# EAGLE design oneLab PCB V4 (EAGLE 9.6.2)
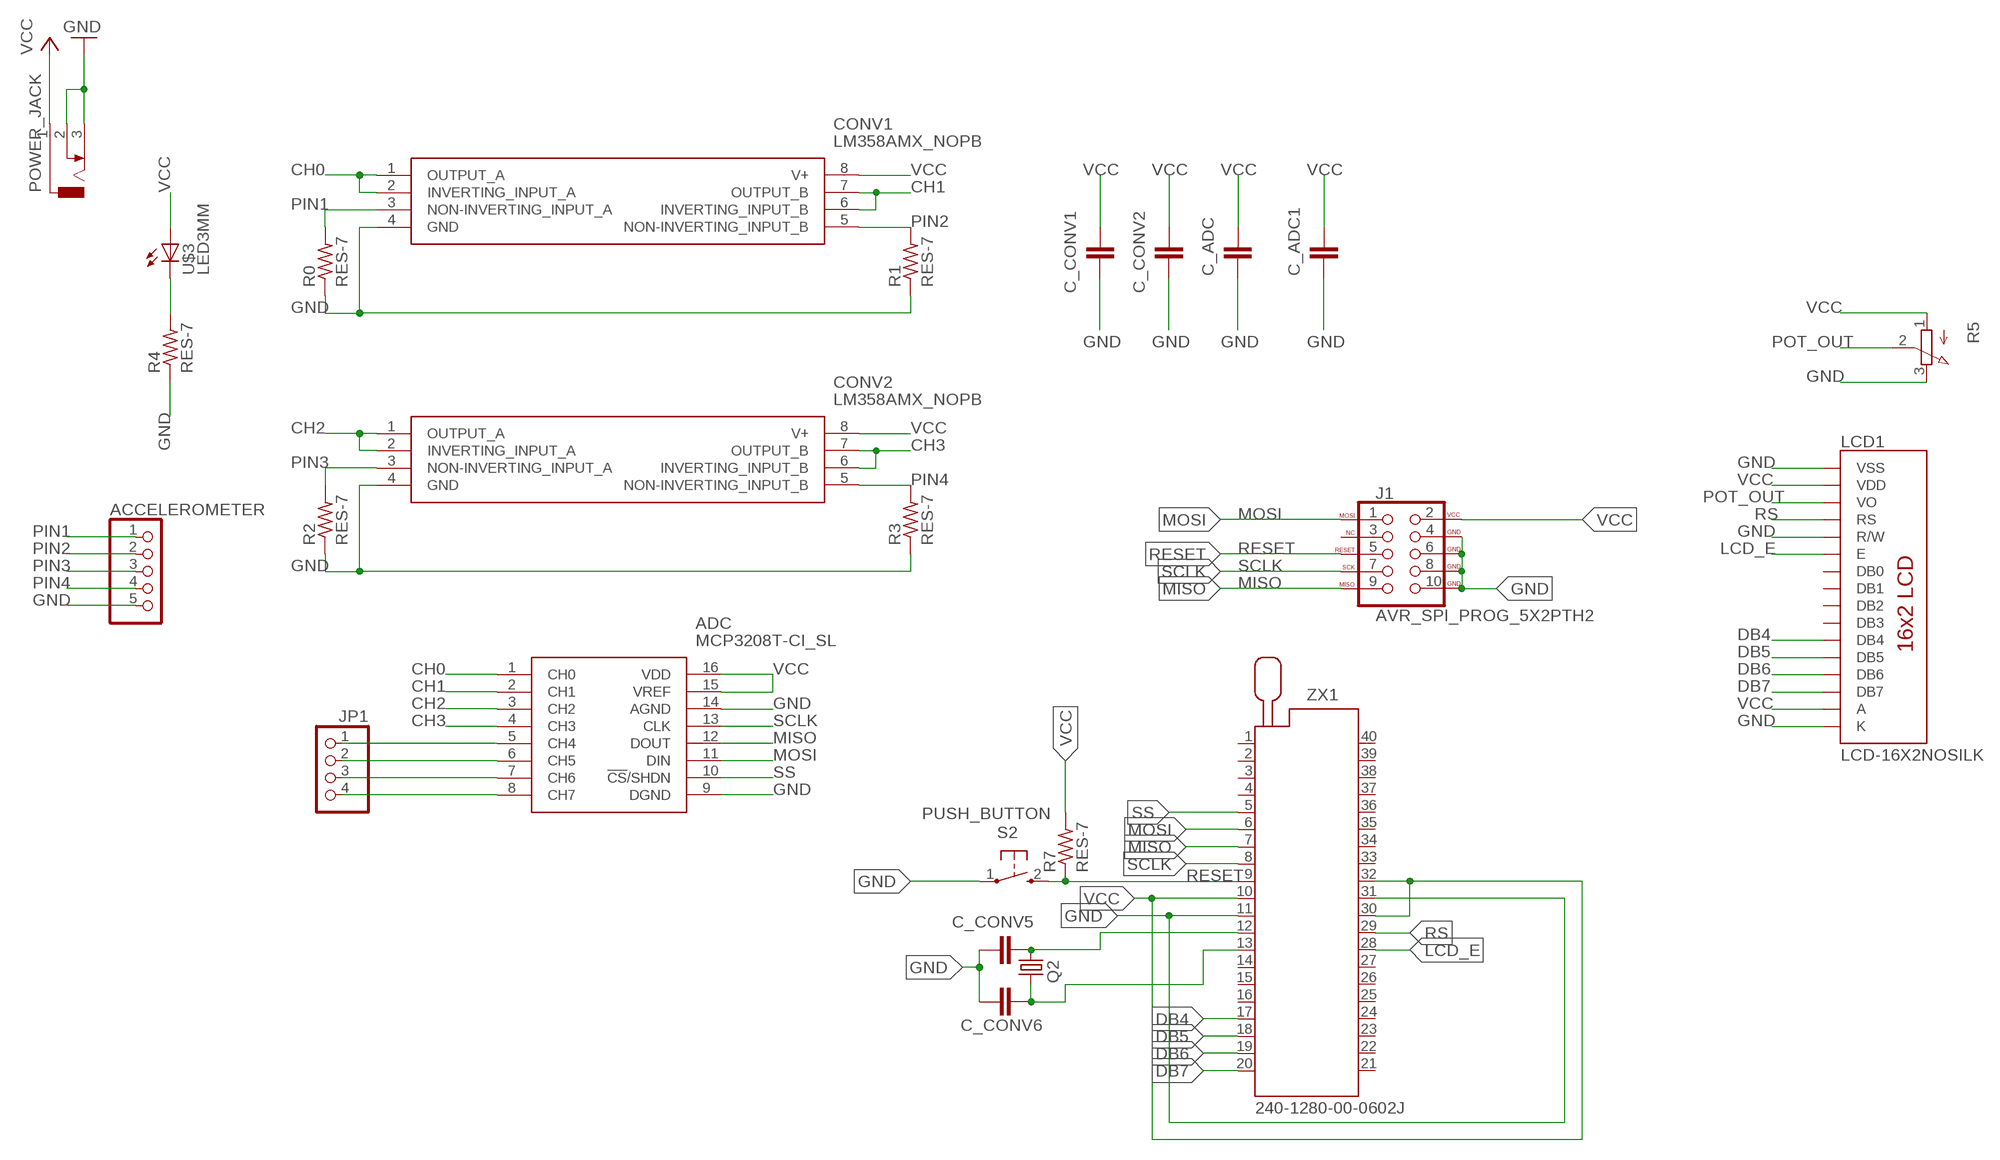
[diagram p0: schematic, sheet 1]

## Parts
ACCELEROMETER  PINHD-5_DATA  [1X05_DATA]
ADC  MCP3208T-CI_SL  [SOIC127P600X175-16N]
C_ADC  CAPACITOR  [C025-025X050]
C_ADC1  CAPACITOR  [C025-025X050]
C_CONV1  CAPACITOR  [C025-025X050]
C_CONV2  CAPACITOR  [C025-025X050]
C_CONV5  CAPACITOR  [C025-025X050]
C_CONV6  CAPACITOR  [C025-025X050]
CONV1  LM358AMX_NOPB  [SOIC127P600X175-8N]
CONV2  LM358AMX_NOPB  [SOIC127P600X175-8N]
J1  AVR_SPI_PROG_5X2PTH2  [2X5-SHROUDED]
JP1  PINHD-4_DATA  [1X04_DATA]
LCD1  LCD-16X2NOSILK  [LCD-16X2_NOSILK]
POWER_JACK  CON_JACK  [DCJ0303]
Q2  CRYSTALHC49U-V  [HC49U-V]
R0  RES-7  [0204/7]
R1  RES-7  [0204/7]
R2  RES-7  [0204/7]
R3  RES-7  [0204/7]
R4  RES-7  [0204/7]
R5  POT  [3RP/1610N]
R7  RES-7  [0204/7]
S2  PUSH_BUTTON  [B3F-10XX]
U$3  LED3MM  [LED3MM]
ZX1  240-1280-00-0602J  [240-1280-00-0602J]

## Nets
CH0: ADC.1(CH0) CONV1.1(OUTPUT_A) CONV1.2(INVERTING_INPUT_A)
CH1: ADC.2(CH1) CONV1.6(INVERTING_INPUT_B) CONV1.7(OUTPUT_B)
CH2: ADC.3(CH2) CONV2.1(OUTPUT_A) CONV2.2(INVERTING_INPUT_A)
CH3: ADC.4(CH3) CONV2.6(INVERTING_INPUT_B) CONV2.7(OUTPUT_B)
DB4: LCD1.11(DB4) ZX1.17
DB5: LCD1.12(DB5) ZX1.18
DB6: LCD1.13(DB6) ZX1.19
DB7: LCD1.14(DB7) ZX1.20
GND: ACCELEROMETER.5 ADC.9(DGND) ADC.14(AGND) C_ADC1.2 C_ADC.2 C_CONV1.2 C_CONV2.2 C_CONV5.1 C_CONV6.1 CONV1.4(GND) CONV2.4(GND) J1.4(GND) J1.6(GND) J1.8(GND) J1.10(GND) LCD1.1(VSS) LCD1.5(R/W) LCD1.16(K) POWER_JACK.2 POWER_JACK.3 R0.1 R1.1 R2.1 R3.1 R4.1 R5.3(E) S2.1(P) ZX1.11 ZX1.31
LCD_E: LCD1.6(E) ZX1.28
MISO: ADC.12(DOUT) J1.9(MISO) ZX1.7
MOSI: ADC.11(DIN) J1.1(MOSI) ZX1.6
N$1: ADC.5(CH4) JP1.1
N$2: ADC.6(CH5) JP1.2
N$3: ADC.7(CH6) JP1.3
N$4: ADC.8(CH7) JP1.4
N$9: C_CONV5.2 Q2.2 ZX1.12
N$10: R4.2 U$3.K(C)
N$11: C_CONV6.2 Q2.1 ZX1.13
PIN1: ACCELEROMETER.1 CONV1.3(NON-INVERTING_INPUT_A) R0.2
PIN2: ACCELEROMETER.2 CONV1.5(NON-INVERTING_INPUT_B) R1.2
PIN3: ACCELEROMETER.3 CONV2.3(NON-INVERTING_INPUT_A) R2.2
PIN4: ACCELEROMETER.4 CONV2.5(NON-INVERTING_INPUT_B) R3.2
POT_OUT: LCD1.3(VO) R5.2(S)
RESET: J1.5(RESET) R7.1 S2.2(S) ZX1.9
RS: LCD1.4(RS) ZX1.29
SCLK: ADC.13(CLK) J1.7(SCK) ZX1.8
SS: ADC.10(!CS!/SHDN) ZX1.5
VCC: ADC.15(VREF) ADC.16(VDD) C_ADC1.1 C_ADC.1 C_CONV1.1 C_CONV2.1 CONV1.8(V+) CONV2.8(V+) J1.2(VCC) LCD1.2(VDD) LCD1.15(A) POWER_JACK.1 R5.1(A) R7.2 U$3.A ZX1.10 ZX1.30 ZX1.32
Unconnected: J1.3(NC) LCD1.7(DB0) LCD1.8(DB1) LCD1.9(DB2) LCD1.10(DB3) ZX1.1 ZX1.2 ZX1.3 ZX1.4 ZX1.14 ZX1.15 ZX1.16 ZX1.21 ZX1.22 ZX1.23 ZX1.24 ZX1.25 ZX1.26 ZX1.27 ZX1.33 ZX1.34 ZX1.35 ZX1.36 ZX1.37 ZX1.38 ZX1.39 ZX1.40

## Library data of the parts
ACCELEROMETER = MIA_LIBRARY-2-2-2:PINHD-5_DATA: PIN HEADER
ADC = oneLab Lib:MCP3208T-CI_SL: Microchip Technology MCP3208T-CI/SL, 12 bit Serial ADC Pseudo Differential Input, 16-Pin SOIC Source: Datasheet <https://ww1.microchip.com/downloads/en/DeviceDoc/21298c.pdf>; ARROW_PART_NUMBER: MCP3208T-CI/SL; ARROW_PRICE-STOCK: https://www.arrow.com/en/products/mcp3208t-cisl/microchip-technology; DESCRIPTION: Microchip Technology MCP3208T-CI/SL, 12 bit Serial ADC Pseudo Differential Input, 16-Pin SOIC; HEIGHT: 1.75mm; MANUFACTURER_NAME: Microchip; MANUFACTURER_PART_NUMBER: MCP3208T-CI/SL; MOUSER_PART_NUMBER: 579-MCP3208T-CI/SL; MOUSER_PRICE-STOCK: https://www.mouser.co.uk/ProductDetail/Microchip-Technology/MCP3208T-CI-SL?qs=qUiwOUCta0eE3HgCyUY2CA%3D%3D
C_ADC C_ADC1 C_CONV1 C_CONV2 C_CONV5 C_CONV6 = oneLab Lib:CAPACITOR
CONV1 CONV2 = oneLab Lib:LM358AMX_NOPB: Operational Amplifiers - Op Amps LOW PWR DUAL OP AMP Source: Datasheet <http://www.ti.com/lit/ds/symlink/lm358-n.pdf>; ARROW_PART_NUMBER: LM358AMX/NOPB; ARROW_PRICE-STOCK: https://www.arrow.com/en/products/lm358amxnopb/texas-instruments; DESCRIPTION: Operational Amplifiers - Op Amps LOW PWR DUAL OP AMP; HEIGHT: 1.75mm; MANUFACTURER_NAME: Texas Instruments; MANUFACTURER_PART_NUMBER: LM358AMX/NOPB; MOUSER_PART_NUMBER: 926-LM358AMX/NOPB; MOUSER_PRICE-STOCK: https://www.mouser.co.uk/ProductDetail/Texas-Instruments/LM358AMX-NOPB?qs=QbsRYf82W3GCS6w419KcQg%3D%3D
J1 = oneLab Lib:AVR_SPI_PROG_5X2: AVR 10-pin ICSP Header This is the standard AVR In Circuit Serial Programming header. Minimal, but includes pin one indicator. Works with standard Olimex programmers. SparkFun Products: 2x5 AVR ICSP Male Header <https://www.sparkfun.com/products/778> - PTH 2x5 Pin Shrouded Header <https://www.sparkfun.com/products/8506> - PTH2; PROD_ID: CONN-08671; SF_ID: PRT-08506
JP1 = oneLab Lib:PINHD-4_DATA: PIN HEADER
LCD1 = oneLab Lib:LCD-16X2: Standard text-only 16x2 parallel input LCD Basic 16 character by 2 line display. Typically utilizes the extremely common HD44780 parallel interface chipset SparkFun Products: Basic 16x2 Green <https://www.sparkfun.com/products/255> Basic 8x2 Green <https://www.sparkfun.com/products/11122>; SF_ID: LCD-00255
POWER_JACK = oneLab Lib:CON_JACK: DC POWER JACK Source: DCJ0303.pdf; OC_FARNELL: unknown; OC_NEWARK: unknown
Q2 = oneLab Lib:CRYSTAL: CRYSTAL; OC_FARNELL: 1666969; OC_NEWARK: unknown
R0 R1-R4 R7 = oneLab Lib:RES-7
R5 = oneLab Lib:POT: 16mm Potentiometer one level Source: http://www.alphapotentiometers.net/html/16mm_pot_2.html
S2 = oneLab Lib:PUSH_BUTTON: OMRON SWITCH
U$3 = oneLab Lib:LED3MM
ZX1 = oneLab Lib:240-?-00-0602J: Zero Insertion Force Socked Source: http://www.3M.com/ehpd

## Board
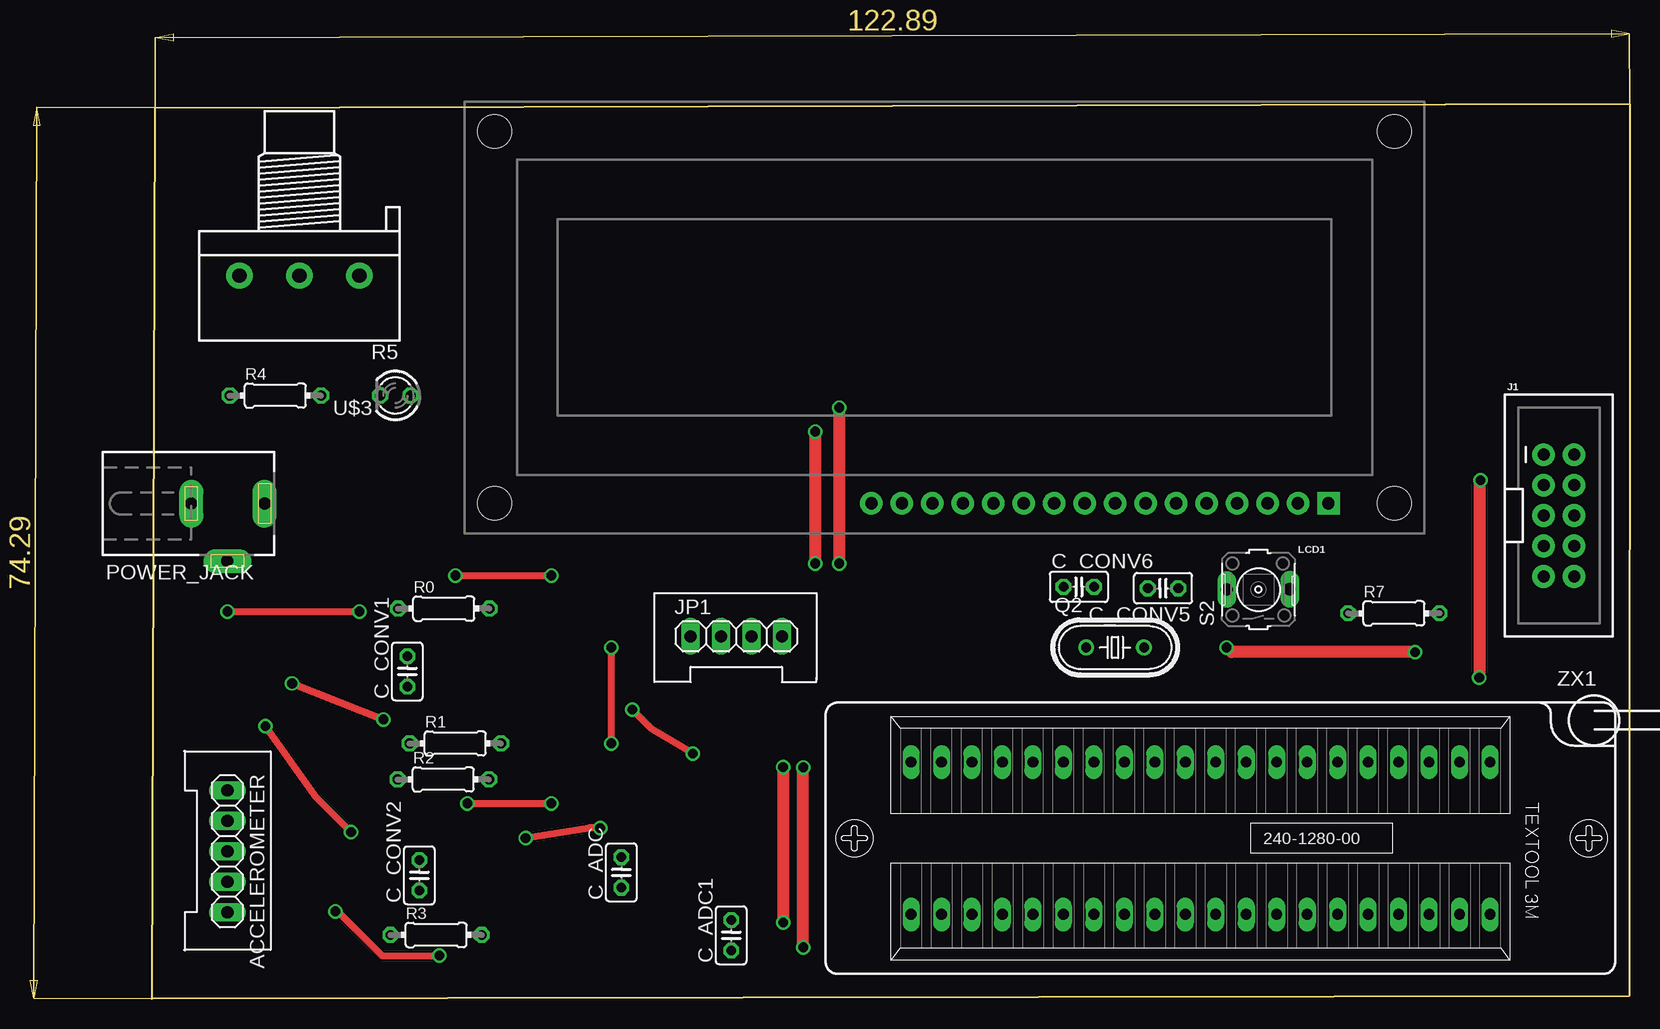
[diagram p1: board, top side]
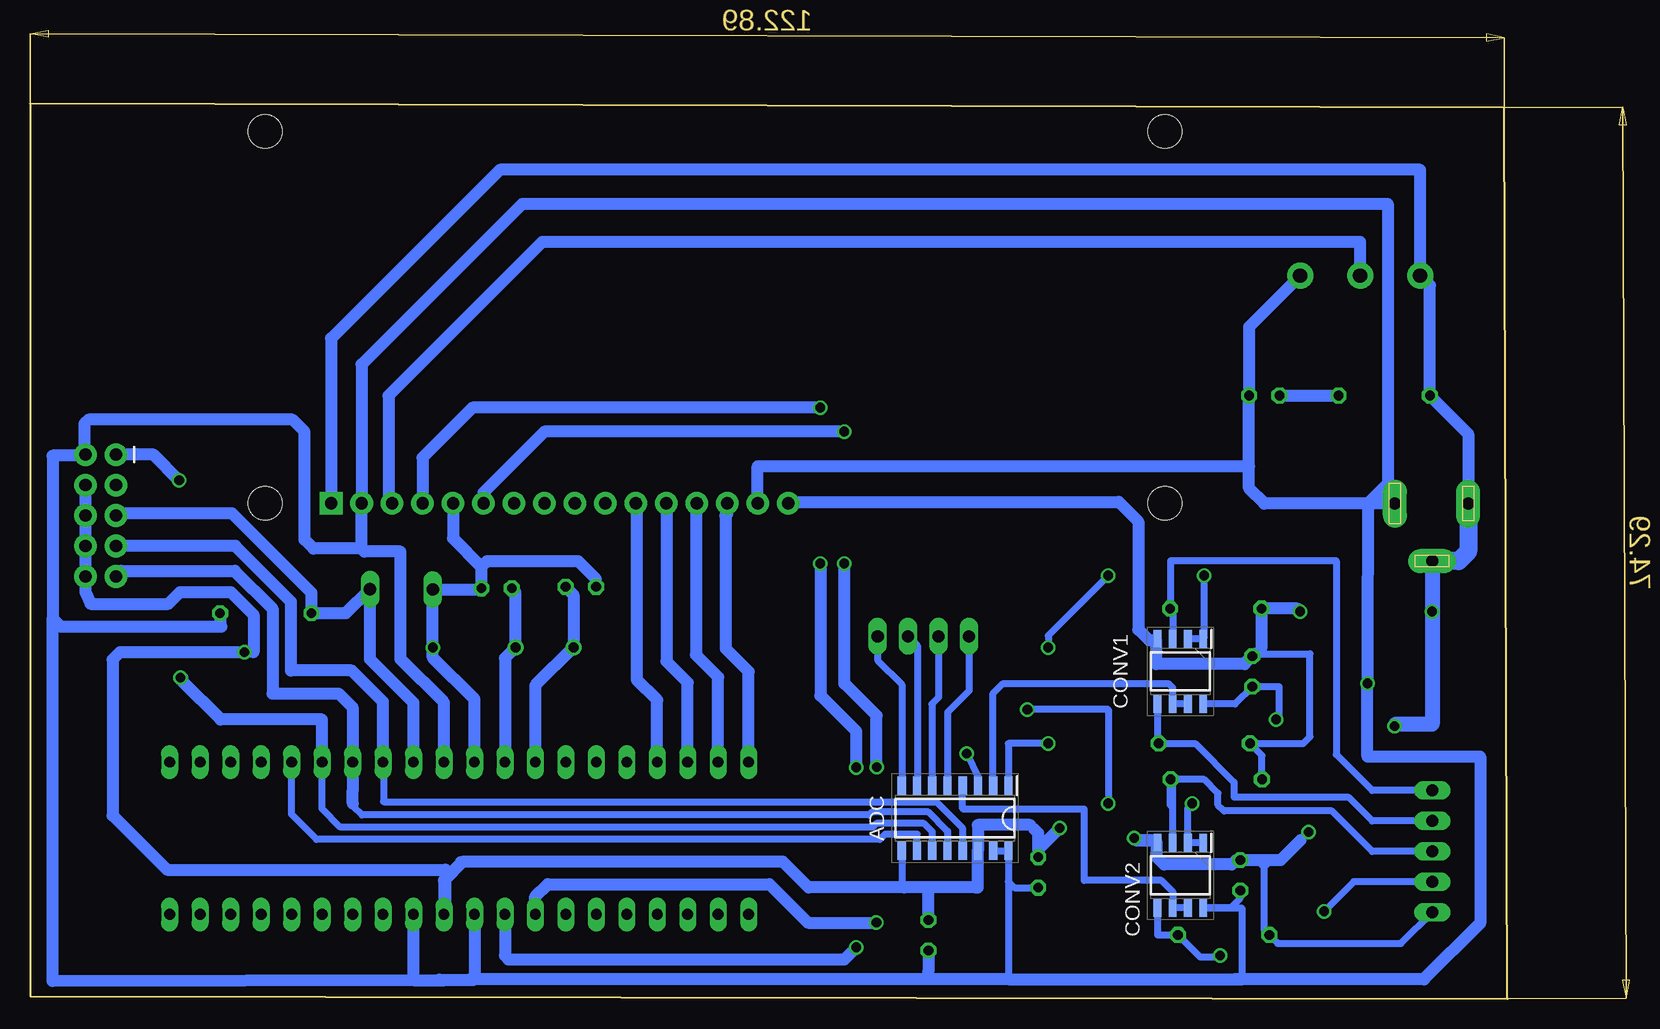
[diagram p2: board, bottom side, seen from below]

Size 123.16 x 74.63 mm. Coordinates in mm from the lower left corner, seen from the top.
Outline: 0.27,74.29 123.16,74.63 123.13,0.22 0,0 0.27,74.29
Copper layers (1*16): Top 0.035mm / dielectric 1.5mm / Bottom 0.035mm
Design rules "default *": minimum track width 0.6mm, minimum drill 0.35mm, track to track 0.25mm, track to pad 0.25mm, pad to pad 0.25mm, via to via 0.25mm, smd to smd 0.25mm, copper to edge 0.4mm, drill to drill 6mil, minimum pad ring 10mil, minimum via ring 8mil, stop-mask expansion 4mil, vias tented up to drill 0mil, thermal gap 10mil

### Footprints (pad centres in the part's own frame; a part is rotated, then mirrored left to right if it is on the bottom)
1X05_DATA = drill 1.016 long: 1 -5.08,0; 2 -2.54,0; 3 0,0; 4 2.54,0; 5 5.08,0
SOIC127P600X175-16N = smd 1.525 x 0.7: 1 -2.712,4.445; 2 -2.712,3.175; 3 -2.712,1.905; 4 -2.712,0.635; 5 -2.712,-0.635; 6 -2.712,-1.905; 7 -2.712,-3.175; 8 -2.712,-4.445; 9 2.712,-4.445; 10 2.712,-3.175; 11 2.712,-1.905; 12 2.712,-0.635; 13 2.712,0.635; 14 2.712,1.905; 15 2.712,3.175; 16 2.712,4.445
C025-025X050 = drill 0.813 octagon: 1 -1.27,0; 2 1.27,0
SOIC127P600X175-8N = smd 1.528 x 0.65: 1 -2.711,1.905; 2 -2.711,0.635; 3 -2.711,-0.635; 4 -2.711,-1.905; 5 2.711,-1.905; 6 2.711,-0.635; 7 2.711,0.635; 8 2.711,1.905
2X5-SHROUDED = drill 1.016 pad 1.88: 1 -1.27,5.08; 2 1.27,5.08; 3 -1.27,2.54; 4 1.27,2.54; 5 -1.27,0; 6 1.27,0; 7 -1.27,-2.54; 8 1.27,-2.54; 9 -1.27,-5.08; 10 1.27,-5.08
1X04_DATA = drill 1.016 long: 1 -3.81,0; 2 -1.27,0; 3 1.27,0; 4 3.81,0
LCD-16X2_NOSILK = drill 1.016 pad 1.88 square: 1 -32,15.5 | drill 1.016 pad 1.88: 2 -29.46,15.5; 3 -26.92,15.5; 4 -24.38,15.5; 5 -21.84,15.5; 6 -19.3,15.5; 7 -16.76,15.5; 8 -14.22,15.5; 9 -11.68,15.5; 10 -9.14,15.5; 11 -6.6,15.5; 12 -4.06,15.5; 13 -1.52,15.5; 14 1.02,15.5; 15 3.56,15.5; 16 6.1,15.5 | hole 2.8: -37.5,15.5; -37.5,-15.5; 37.5,15.5; 37.5,-15.5
DCJ0303 = drill 1 pad 2 long: 1 0,3.1; 2 4.8,0; 3 0,-3
HC49U-V = drill 0.813: 1 -2.413,0; 2 2.413,0
0204/7 = drill 0.813 octagon: 1 -3.81,0; 2 3.81,0
3RP/1610N = drill 1.2 pad 2.184: 1 -5,0; 2 0,0; 3 5,0
B3F-10XX = drill 1.016 long: 1 0.013,2.636; 2 0.029,-2.605
LED3MM = drill 0.813 octagon: A -1.27,0; K 1.27,0
240-1280-00-0602J = drill 0.9 long: 1 -24.13,-6.35; 2 -21.59,-6.35; 3 -19.05,-6.35; 4 -16.51,-6.35; 5 -13.97,-6.35; 6 -11.43,-6.35; 7 -8.89,-6.35; 8 -6.35,-6.35; 9 -3.81,-6.35; 10 -1.27,-6.35; 11 1.27,-6.35; 12 3.81,-6.35; 13 6.35,-6.35; 14 8.89,-6.35; 15 11.43,-6.35; 16 13.97,-6.35; 17 16.51,-6.35; 18 19.05,-6.35; 19 21.59,-6.35; 20 24.13,-6.35; 21 24.13,6.35; 22 21.59,6.35; 23 19.05,6.35; 24 16.51,6.35; 25 13.97,6.35; 26 11.43,6.35; 27 8.89,6.35; 28 6.35,6.35; 29 3.81,6.35; 30 1.27,6.35; 31 -1.27,6.35; 32 -3.81,6.35; 33 -6.35,6.35; 34 -8.89,6.35; 35 -11.43,6.35; 36 -13.97,6.35; 37 -16.51,6.35; 38 -19.05,6.35; 39 -21.59,6.35; 40 -24.13,6.35

### Placement (x,y rotation side)
ACCELEROMETER  6.27,12.29 270 top
ADC  46.05,15.06 270 bottom
C_ADC  39.12,10.54 90 top
C_ADC1  48.27,5.29 90 top
C_CONV1  21.27,27.29 90 top
C_CONV2  22.27,10.29 90 top
C_CONV5  84.27,34.22 180 top
C_CONV6  77.25,34.35 0 top
CONV1  27.27,27.29 270 bottom
CONV2  27.27,10.29 270 bottom
J1  117.27,40.29 0 top
JP1  48.69,30.22 0 top
LCD1  66.06,56.81 180 top
POWER_JACK  6.27,41.29 270 top
Q2  80.27,29.29 0 top
R0  24.32,32.53 0 top
R1  25.27,21.29 0 top
R2  24.27,18.29 0 top
R3  23.67,5.32 0 top
R4  10.27,50.29 0 top
R5  12.27,60.29 180 top
R7  103.51,32.14 0 top
S2  92.22,34.12 90 top
U$3  20.27,50.29 180 top
ZX1  87.39,13.39 180 top

### Tracks (layer width: path | path; a pad name or v marks a point on that pad's centre or on a via)
CH0  (via drill 0.8)
  Top 0.6: v25.27,35.29 v33.27,35.29 | v38.27,29.29 v38.27,21.29
  Bottom 0.6: CONV1.2 CONV1.1 25.27,30.1 v25.27,35.29 | v33.27,35.29 38.27,30.29 v38.27,29.29 | v38.27,21.29 41.61,21.29 ADC.1
CH1
  Bottom 0.6: CONV1.7 CONV1.6 27.91,25.93 28.27,26.29 42.05,26.29 42.88,25.47 ADC.2
CH2  (via drill 0.8)
  Top 0.6: v26.27,16.29 v33.27,16.29 | v45.07,20.44 45.07,20.45 41.62,22.52 v40.02,24.12
  Bottom 0.6: CONV2.1 CONV2.2 26.64,15.93 v26.27,16.29 | v33.27,16.29 33.27,24.12 v40.02,24.12 | v45.07,20.44 44.12,18.5 ADC.3
CH3
  Bottom 0.6: CONV2.7 CONV2.6 27.91,8.93 28.84,9.86 35.27,9.86 35.27,15.82 45.42,15.85 ADC.4
DB4
  Bottom 1: ZX1.17 70.88,24.9 72.59,26.61 72.59,41.23 LCD1.11
DB5
  Bottom 1: ZX1.18 68.34,26.36 70.12,28.14 LCD1.12
DB6
  Bottom 1: ZX1.19 65.8,26.82 67.66,28.68 67.66,41.23 LCD1.13
DB7
  Bottom 1: ZX1.20 63.26,27.28 65.15,29.17 65.15,40.24 65.2,40.29 65.04,40.45 LCD1.14
GND  (via drill 0.8, 0.8 pad 1)
  Top 0.6: v6.27,32.29 v17.27,32.29 | v16.59,13.89 13.69,16.79 v9.43,22.75 | v37.34,14.22 37.32,14.25 36.39,14.25 31.12,13.41 v31.14,13.41
  Top 1: v105.27,28.91 89.97,28.91 v89.59,29.29
  Bottom 0.6: 44.59,9.29 44.32,9.29 44.14,9.29 | 39.44,14.13 39.8,14.49 | 44.32,14.49 44.27,14.49 44.27,14.29 44.14,14.49 | 20.51,29.33 C_CONV1.2 | 21.07,28.77 16.47,28.77 16.47,21.85 17.03,21.29 R1.1 20.46,20.29 R2.1 | 20.27,11.29 20.27,5.74 R3.1 19.15,4.61 8.87,4.61 ACCELEROMETER.5 | 29.27,29.91 CONV1.4 | v17.27,32.29 17.51,32.53 | v16.59,13.89 17.23,13.25 | 20.27,11.56 20.54,11.56 | 29.37,13.2 29.59,13.41 v31.14,13.41 | ADC.9 50.5,9.51 50.27,9.29 | CONV2.4 29.27,13.29 29.26,13 | J1.8 118.77,37.79 118.54,37.79 | 118.77,40.29 J1.6
  Bottom 0.8: CONV2.4 29.37,13.2
  Bottom 1: 60.4,11.44 87.14,11.4 88.66,9.88 ZX1.31 88.56,7.14 88.56,10.76 111.74,10.76 116.27,15.29 116.27,28.29 115.66,28.91 v105.27,28.91 104.53,28.91 104.53,32.02 106.43,33.91 110.65,33.91 111.63,32.93 118.12,32.93 118.54,33.91 J1.10 J1.8 118.54,37.79 J1.6 J1.4 | 60.4,11.44 87.27,11.4 | 20.51,29.33 R0.1 17.51,32.53 | 21.07,28.77 C_CONV1.2 21.94,27.9 29.27,27.9 29.27,29.91 29.89,29.91 30.77,30.79 30.77,39.79 32.41,41.43 59.84,41.43 LCD1.16 | POWER_JACK.3 3.27,47.1 R4.1 6.46,59.48 R5.3 7.27,69.11 84,69.11 98.06,55.05 LCD1.1 | C_CONV6.1 75.98,35 77.45,36.47 85.09,36.47 85.54,36.02 | 85.54,36.02 C_CONV5.1 85.64,34.13 S2.1 v89.59,29.29 89.59,28.45 86.12,24.98 ZX1.11 | LCD1.5 87.9,38.38 85.54,36.02 | 44.32,9.29 48.27,9.29 | 48.27,9.29 50.27,9.29 58.25,9.29 60.4,11.44 | 39.44,14.13 39.12,13.81 C_ADC.2 39.12,12.45 v37.34,14.22 | 39.8,14.49 44.14,14.49 ADC.14 44.14,9.29 | 17.23,13.25 18.91,11.56 20.27,11.56 | 20.27,11.29 20.54,11.56 C_CONV2.2 22.63,11.56 23.01,11.19 28.63,11.19 29.26,11.82 29.26,13 | v31.14,13.41 30.92,13.2 29.37,13.2 | C_ADC1.2 48.27,9.29
  Bottom 1.27: POWER_JACK.2 v6.27,32.29 6.27,22.9 9.27,22.9 v9.43,22.75
  Bottom 1.5: POWER_JACK.3 3.27,37.29 4.07,36.49 POWER_JACK.2
LCD_E  (via drill 0.8)
  Top 1: v52.6,6.35 52.59,6.36 v52.59,19.33 | v55.27,47.29 v55.27,36.29
  Bottom 1: ZX1.28 81.04,8.53 80.02,9.55 61.53,9.55 58.33,6.35 v52.6,6.35 | v52.59,19.33 52.59,23.61 55.27,26.29 v55.27,36.29 | v55.27,47.29 80.27,47.29 85.36,42.21 LCD1.6
MISO
  Bottom 0.6: ADC.12 46.71,12.38 46.67,13.98 48.27,15.57 52.99,15.57 53.25,15.32 95.49,15.32 96.27,16.1 96.27,16.29 | 96.28,17.29 ZX1.7
  Bottom 1: 96.27,16.29 96.28,17.29 96.28,24.3 97.44,25.46 102.95,25.46 102.95,32.54 106.09,35.68 115.54,35.68 J1.9
MOSI  (via drill 0.8)
  Top 1: v110.63,26.77 110.62,26.78 110.62,43.23 v110.73,43.23
  Bottom 0.6: ADC.11 47.95,13.93 48.65,14.62 52.61,14.62 52.92,14.31 97.29,14.31 98.82,15.84 ZX1.6
  Bottom 1: ZX1.6 98.82,23.29 107.27,23.29 110.46,26.48 110.46,26.77 v110.63,26.77 | v110.73,43.23 112.87,45.37 J1.1
N$1
  Bottom 0.6: JP1.1 44.88,25.68 46.69,23.88 ADC.5
N$2
  Bottom 0.6: JP1.2 47.42,25.14 47.99,24.58 47.99,17.81 ADC.6
N$3
  Bottom 0.6: JP1.3 49.2,29.46 49.2,17.98 49.22,17.96 ADC.7
N$4
  Bottom 0.6: JP1.4 52.5,28.22 50.49,26.21 50.49,17.93 50.5,17.93 ADC.8
N$9
  Bottom 1: ZX1.12 83.58,28.4 Q2.2 82.69,33.91 C_CONV5.2
N$10
  Bottom 1: U$3.K R4.2
N$11
  Bottom 1: ZX1.13 81.04,26.11 Q2.1 77.86,33.69 C_CONV6.2
PIN1
  Bottom 0.6: CONV1.3 27.91,32.53 R0.2 28.08,32.58 28.08,36.52 14.27,36.52 14.27,20.37 11.27,17.37 ACCELEROMETER.1
PIN2
  Bottom 0.6: CONV1.5 29.18,21.39 R1.2 26.04,21.29 22.8,18.05 22.8,16.83 13.27,16.83 11.27,14.83 ACCELEROMETER.2
PIN3
  Bottom 0.6: CONV2.3 27.91,18.12 R2.2 | ACCELEROMETER.3 11.27,12.29 14.63,15.65 23.63,15.65 24.12,16.14 24.12,17.14 25.27,18.29 R2.2 | 28.08,16.1 R2.2
PIN4  (via drill 0.8)
  Top 0.6: v15.27,7.29 15.47,7.29 19.16,3.61 v23.96,3.61
  Bottom 0.6: CONV2.5 29.18,5.32 R3.2 25.63,3.48 24.09,3.48 v23.96,3.61 | ACCELEROMETER.4 12.81,9.75 v15.27,7.29
POT_OUT
  Bottom 1: R5.2 12.27,63.1 80.47,63.1 93.27,50.29 93.27,41.6 LCD1.3
RESET
  Bottom 1: ZX1.9 91.2,24.68 94.83,28.3 S2.2 96.83,32.14 R7.1 99.7,33.85 106.34,40.49 115.81,40.49 J1.5
RS  (via drill 0.8)
  Top 1: v54.27,4.29 v54.27,19.29 | v57.27,49.29 v57.27,36.29
  Bottom 1: ZX1.29 83.58,3.6 83.27,3.29 55.27,3.29 v54.27,4.29 | v54.27,19.29 54.27,22.29 57.27,25.29 v57.27,36.29 | v57.27,49.29 86.27,49.29 90.44,45.13 LCD1.4
SCLK
  Bottom 0.6: ADC.13 45.45,12.39 45.45,14.27 47.61,16.43 93.71,16.43 93.71,19.7 ZX1.8
  Bottom 1: ZX1.8 93.74,24.76 96.34,27.36 101.4,27.36 101.4,33.1 106.05,37.75 J1.7
SS
  Bottom 0.6: ADC.10 49.22,13.71 49.24,13.73 51.89,13.73 52.32,13.29 99.27,13.29 101.36,15.38 ZX1.5
VCC  (via drill 0.8)
  Top 0.6: v11.67,26.29 v19.27,23.29
  Bottom 0.6: ADC.15 ADC.16 | ADC.16 41.61,9.75 41.12,9.27 C_ADC.1 | CONV1.8 22.72,24.58 C_CONV1.1 19.05,26.02 19.04,26.02 19.04,23.52 v19.27,23.29 | C_CONV2.1 22.27,8.38 23.07,7.58 CONV2.8 22.15,7.58 22.15,1.62 | ADC.16 41.61,1.65 41.61,1.64 | 48.27,2.29 48.27,1.64
  Bottom 1: R5.1 21.54,56.02 U$3.A 21.54,44.4 | 11.65,41.29 20.27,41.29 21.54,42.56 21.54,44.4 | POWER_JACK.1 11.65,41.29 | 11.65,41.29 11.67,29.29 v11.67,26.29 11.68,20.21 2.27,20.19 2.27,6.29 6.96,1.61 22.75,1.61 22.71,1.65 | 22.15,1.62 22.18,1.65 41.61,1.65 | 11.65,41.29 9.98,42.96 9.98,66.28 82.12,66.28 95.52,52.89 LCD1.2 95.52,37.54 | ZX1.32 91.2,1.56 88.71,1.56 88.69,1.54 89.11,1.54 | R7.2 107.32,31.15 107.2,31.03 120.61,31.03 121.27,31.69 | J1.2 118.62,45.29 | 118.62,45.29 121.27,45.29 121.27,31.69 | LCD1.15 62.5,44.4 21.54,44.4 | ZX1.10 88.66,24.7 92.27,28.31 92.27,37.29 95.27,37.29 95.52,37.54 | 118.62,45.29 118.62,47.94 118.27,48.29 101.27,48.29 100.27,47.29 100.27,38.29 99.52,37.54 95.52,37.54 | 89.11,1.54 121.27,1.47 121.27,31.69 | 41.61,1.64 48.27,1.64 86.43,1.64 86.48,1.59 | 89.11,1.54 89.06,1.59 86.12,1.59 ZX1.30 | C_ADC1.1 48.27,2.29